# Altium project 12VRGBCW.PrjPcb
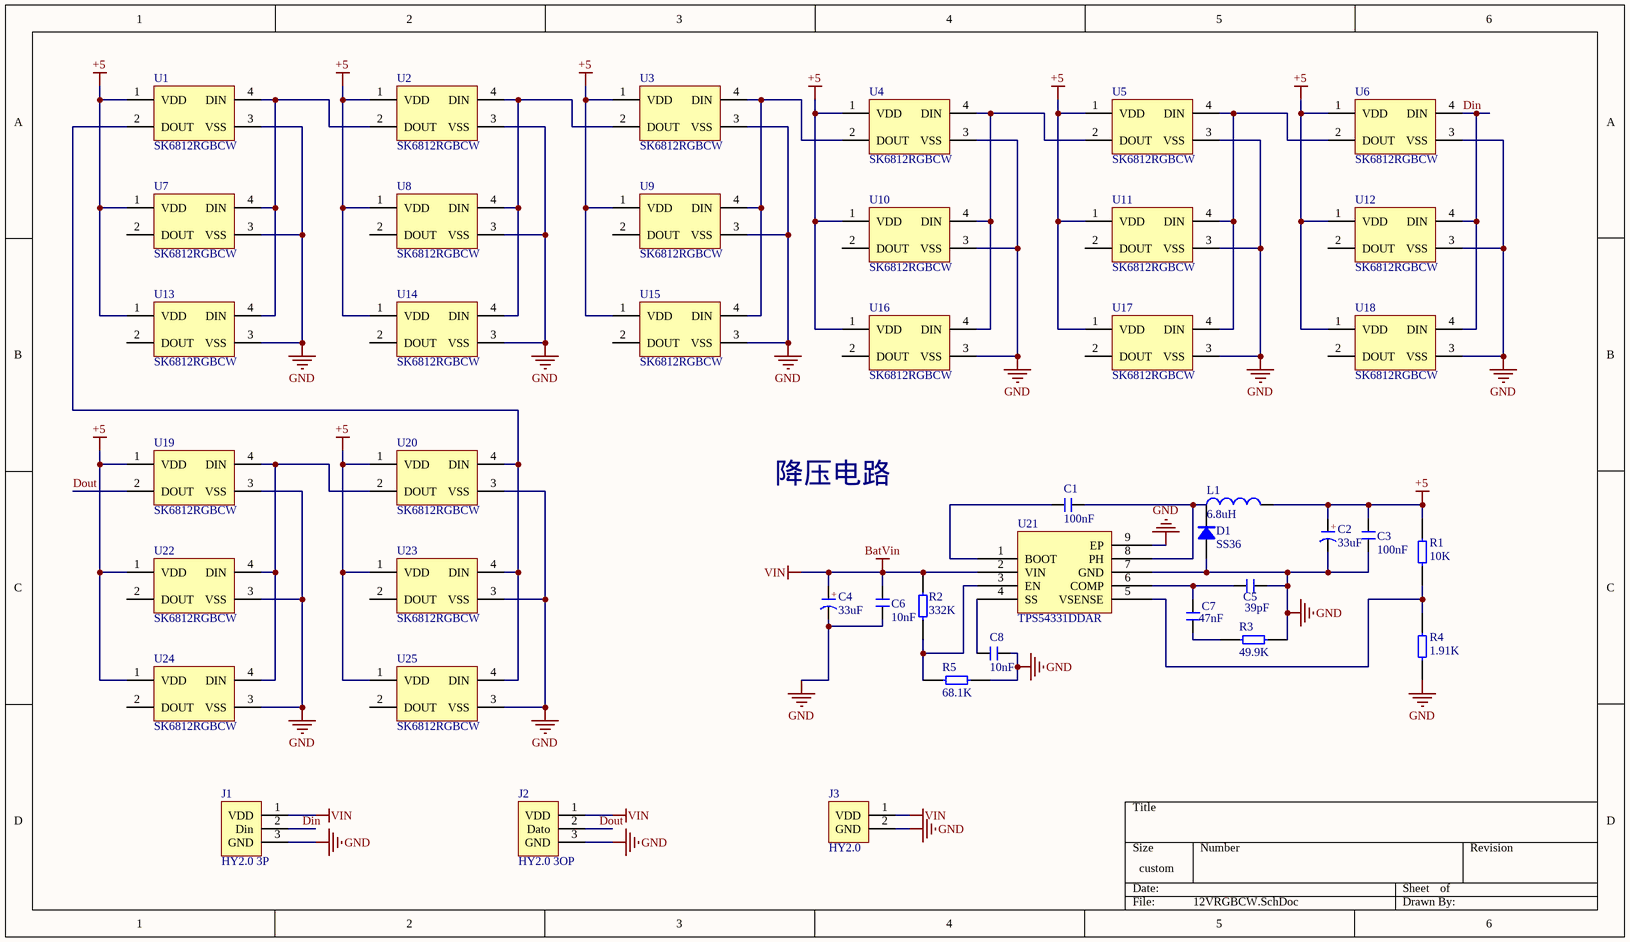
[diagram p0: 12VRGBCW.SchDoc]
1 sheet, 43 parts. Net scope: global (net labels, ports and power ports of the same name join across sheets).
Board file: RGBCW.PcbDoc

## Sheet 12VRGBCW.SchDoc
size 304 x 175 mm

### Parts
C1  100nF  [C 0603_L]
C2  33uF  [CM D(6.3*5.4)]
C3  100nF  [C 0603_M]
C4  33uF  [CM D(6.3*5.4)]
C5  39pF  [C 0603_L]
C6  10nF  [C 0603_L]
C7  47nF  [C 0603_L]
C8  10nF  [C 0603_L]
D1  SS36  [SMA]
J1  HY2.0 3P
J2  HY2.0 3OP
J3  HY2.0
L1  6.8uH  [CDRH73]
R1  10K  [R 0603_M]
R2  332K  [R 0603_M]
R3  49.9K  [R 0603_M]
R4  1.91K  [R 0603_M]
R5  68.1K  [R 0603_M]
U1  SK6812RGBCW
U2  SK6812RGBCW
U3  SK6812RGBCW
U4  SK6812RGBCW
U5  SK6812RGBCW
U6  SK6812RGBCW
U7  SK6812RGBCW
U8  SK6812RGBCW
U9  SK6812RGBCW
U10  SK6812RGBCW
U11  SK6812RGBCW
U12  SK6812RGBCW
U13  SK6812RGBCW
U14  SK6812RGBCW
U15  SK6812RGBCW
U16  SK6812RGBCW
U17  SK6812RGBCW
U18  SK6812RGBCW
U19  SK6812RGBCW
U20  SK6812RGBCW
U21  TPS54331DDAR  [SOP8_M]
U22  SK6812RGBCW
U23  SK6812RGBCW
U24  SK6812RGBCW
U25  SK6812RGBCW

### Nets
+5: C2.1(A) C3.2 L1.2 R1.2 U1.1(VDD) U2.1(VDD) U3.1(VDD) U4.1(VDD) U5.1(VDD) U6.1(VDD) U7.1(VDD) U8.1(VDD) U9.1(VDD) U10.1(VDD) U11.1(VDD) U12.1(VDD) U13.1(VDD) U14.1(VDD) U15.1(VDD) U16.1(VDD) U17.1(VDD) U18.1(VDD) U19.1(VDD) U20.1(VDD) U22.1(VDD) U23.1(VDD) U24.1(VDD) U25.1(VDD)
BatVin: C4.1(A) C6.2 J1.1(VDD) J2.1(VDD) J3.1(VDD) R2.1 U21.2(VIN)  [also labelled VIN]
GND: C2.2(K) C3.1 C4.2(K) C5.1 C6.1 C8.1 D1.1(A) J1.3(GND) J2.3(GND) J3.2(GND) R3.2 R4.1 R5.2 U1.3(VSS) U2.3(VSS) U3.3(VSS) U4.3(VSS) U5.3(VSS) U6.3(VSS) U7.3(VSS) U8.3(VSS) U9.3(VSS) U10.3(VSS) U11.3(VSS) U12.3(VSS) U13.3(VSS) U14.3(VSS) U15.3(VSS) U16.3(VSS) U17.3(VSS) U18.3(VSS) U19.3(VSS) U20.3(VSS) U21.7(GND) U21.9(EP) U22.3(VSS) U23.3(VSS) U24.3(VSS) U25.3(VSS)
Din: J1.2(Din) U6.4(DIN) U12.4(DIN) U18.4(DIN)
Dout: J2.2(Dato) U19.2(DOUT)
NetC1_1: C1.1 U21.1(BOOT)
NetC1_2: C1.2 D1.2(K) L1.1 U21.8(PH)
NetC5_2: C5.2 C7.2 U21.6(COMP)
NetC7_1: C7.1 R3.1
NetC8_2: C8.2 U21.4(SS)
NetR1_1: R1.1 R4.2 U21.5(VSENSE)
NetR2_2: R2.2 R5.1 U21.3(EN)
NetU1_2: U1.2(DOUT) U20.4(DIN) U23.4(DIN) U25.4(DIN)
NetU1_4: U1.4(DIN) U2.2(DOUT) U7.4(DIN) U13.4(DIN)
NetU2_4: U2.4(DIN) U3.2(DOUT) U8.4(DIN) U14.4(DIN)
NetU3_4: U3.4(DIN) U4.2(DOUT) U9.4(DIN) U15.4(DIN)
NetU4_4: U4.4(DIN) U5.2(DOUT) U10.4(DIN) U16.4(DIN)
NetU5_4: U5.4(DIN) U6.2(DOUT) U11.4(DIN) U17.4(DIN)
NetU19_4: U19.4(DIN) U20.2(DOUT) U22.4(DIN) U24.4(DIN)

Not connected (* = marked no-connect by the designer): U7 2(DOUT); U8 2(DOUT); U9 2(DOUT); U10 2(DOUT); U11 2(DOUT); U12 2(DOUT); U13 2(DOUT); U14 2(DOUT); U15 2(DOUT); U16 2(DOUT); U17 2(DOUT); U18 2(DOUT); U22 2(DOUT); U23 2(DOUT); U24 2(DOUT); U25 2(DOUT)

### Notes on the sheet
- 降压电路
- (in symbol C-CS) +

### Library data of the parts
C1 C3 C5-C8 = C: 无极性贴片电容; 材质: X7R; BOM名称: 无极性贴片电容
C2 C4 = C-CS: 直插固态电容; BOM名称: 直插固态电容
D1 = SS36: 肖特基二极管; 属性: 40V/3A; BOM名称: 肖特基二极管
J1 = HY2.0 3P: 数据输入
J3 = HY2.0: 供电接口
L1 = L: 小功率贴片电感; BOM名称: 小功率贴片电感
R1-R5 = Res: 电阻
U1-U20 U22-U25 = SK6812RGBCW: RGB灯珠
U21 = TPS54331DDAR: 压降芯片